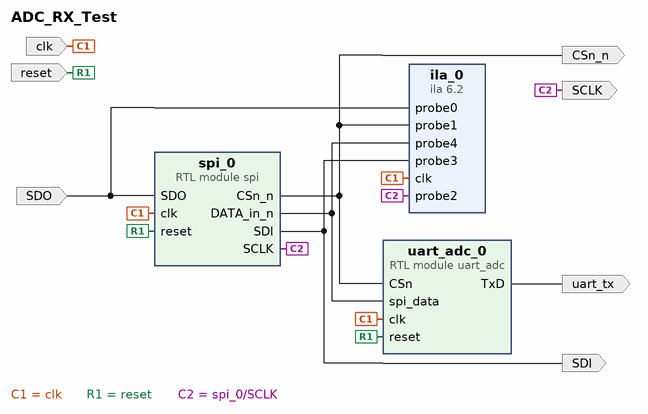
[diagram p0: block diagram of the top level]
# Vivado block design ADC_RX_Test, xc7a100ticsg324-1L, Vivado 2019.1
create_bd_design ADC_RX_Test

create_bd_port -dir I -type clk clk
set_property -dict {CONFIG.FREQ_HZ 100000000} [get_bd_ports clk]
create_bd_port -dir I -type rst reset
set_property -dict {CONFIG.POLARITY ACTIVE_HIGH} [get_bd_ports reset]
create_bd_port -dir I SDO
create_bd_port -dir O SCLK
create_bd_port -dir O SDI
create_bd_port -dir O uart_tx
create_bd_port -dir O CSn_n

create_bd_cell -type module -reference spi spi_0
create_bd_cell -type ip -vlnv xilinx.com:ip:ila:6.2 ila_0
set_property -dict [list \
  CONFIG.C_DATA_DEPTH 65536 \
  CONFIG.C_ENABLE_ILA_AXI_MON false \
  CONFIG.C_MONITOR_TYPE Native \
  CONFIG.C_NUM_OF_PROBES 5 \
  CONFIG.C_PROBE4_WIDTH 8 \
] [get_bd_cells ila_0]
create_bd_cell -type module -reference uart_adc uart_adc_0

# ---- connections ----

connect_bd_net [get_bd_ports clk] [get_bd_pins spi_0/clk] [get_bd_pins ila_0/clk] [get_bd_pins uart_adc_0/clk]
connect_bd_net [get_bd_ports reset] [get_bd_pins spi_0/reset] [get_bd_pins uart_adc_0/reset]
connect_bd_net [get_bd_ports SDO] [get_bd_pins spi_0/SDO] [get_bd_pins ila_0/probe0]
connect_bd_net [get_bd_pins spi_0/SCLK] [get_bd_ports SCLK] [get_bd_pins ila_0/probe2]
connect_bd_net [get_bd_pins spi_0/SDI] [get_bd_ports SDI] [get_bd_pins ila_0/probe3]
connect_bd_net -net spi_0_DATA_in [get_bd_pins spi_0/DATA_in_n] [get_bd_pins ila_0/probe4] [get_bd_pins uart_adc_0/spi_data]
connect_bd_net -net uart_adc_0_uart_tx [get_bd_pins uart_adc_0/TxD] [get_bd_ports uart_tx]
connect_bd_net [get_bd_pins spi_0/CSn_n] [get_bd_pins ila_0/probe1] [get_bd_ports CSn_n] [get_bd_pins uart_adc_0/CSn]

validate_bd_design
save_bd_design
